# Altium schematic sheet Payload PC104.SchDoc
size A3; SheetNumber: 1; SheetTotal: 1
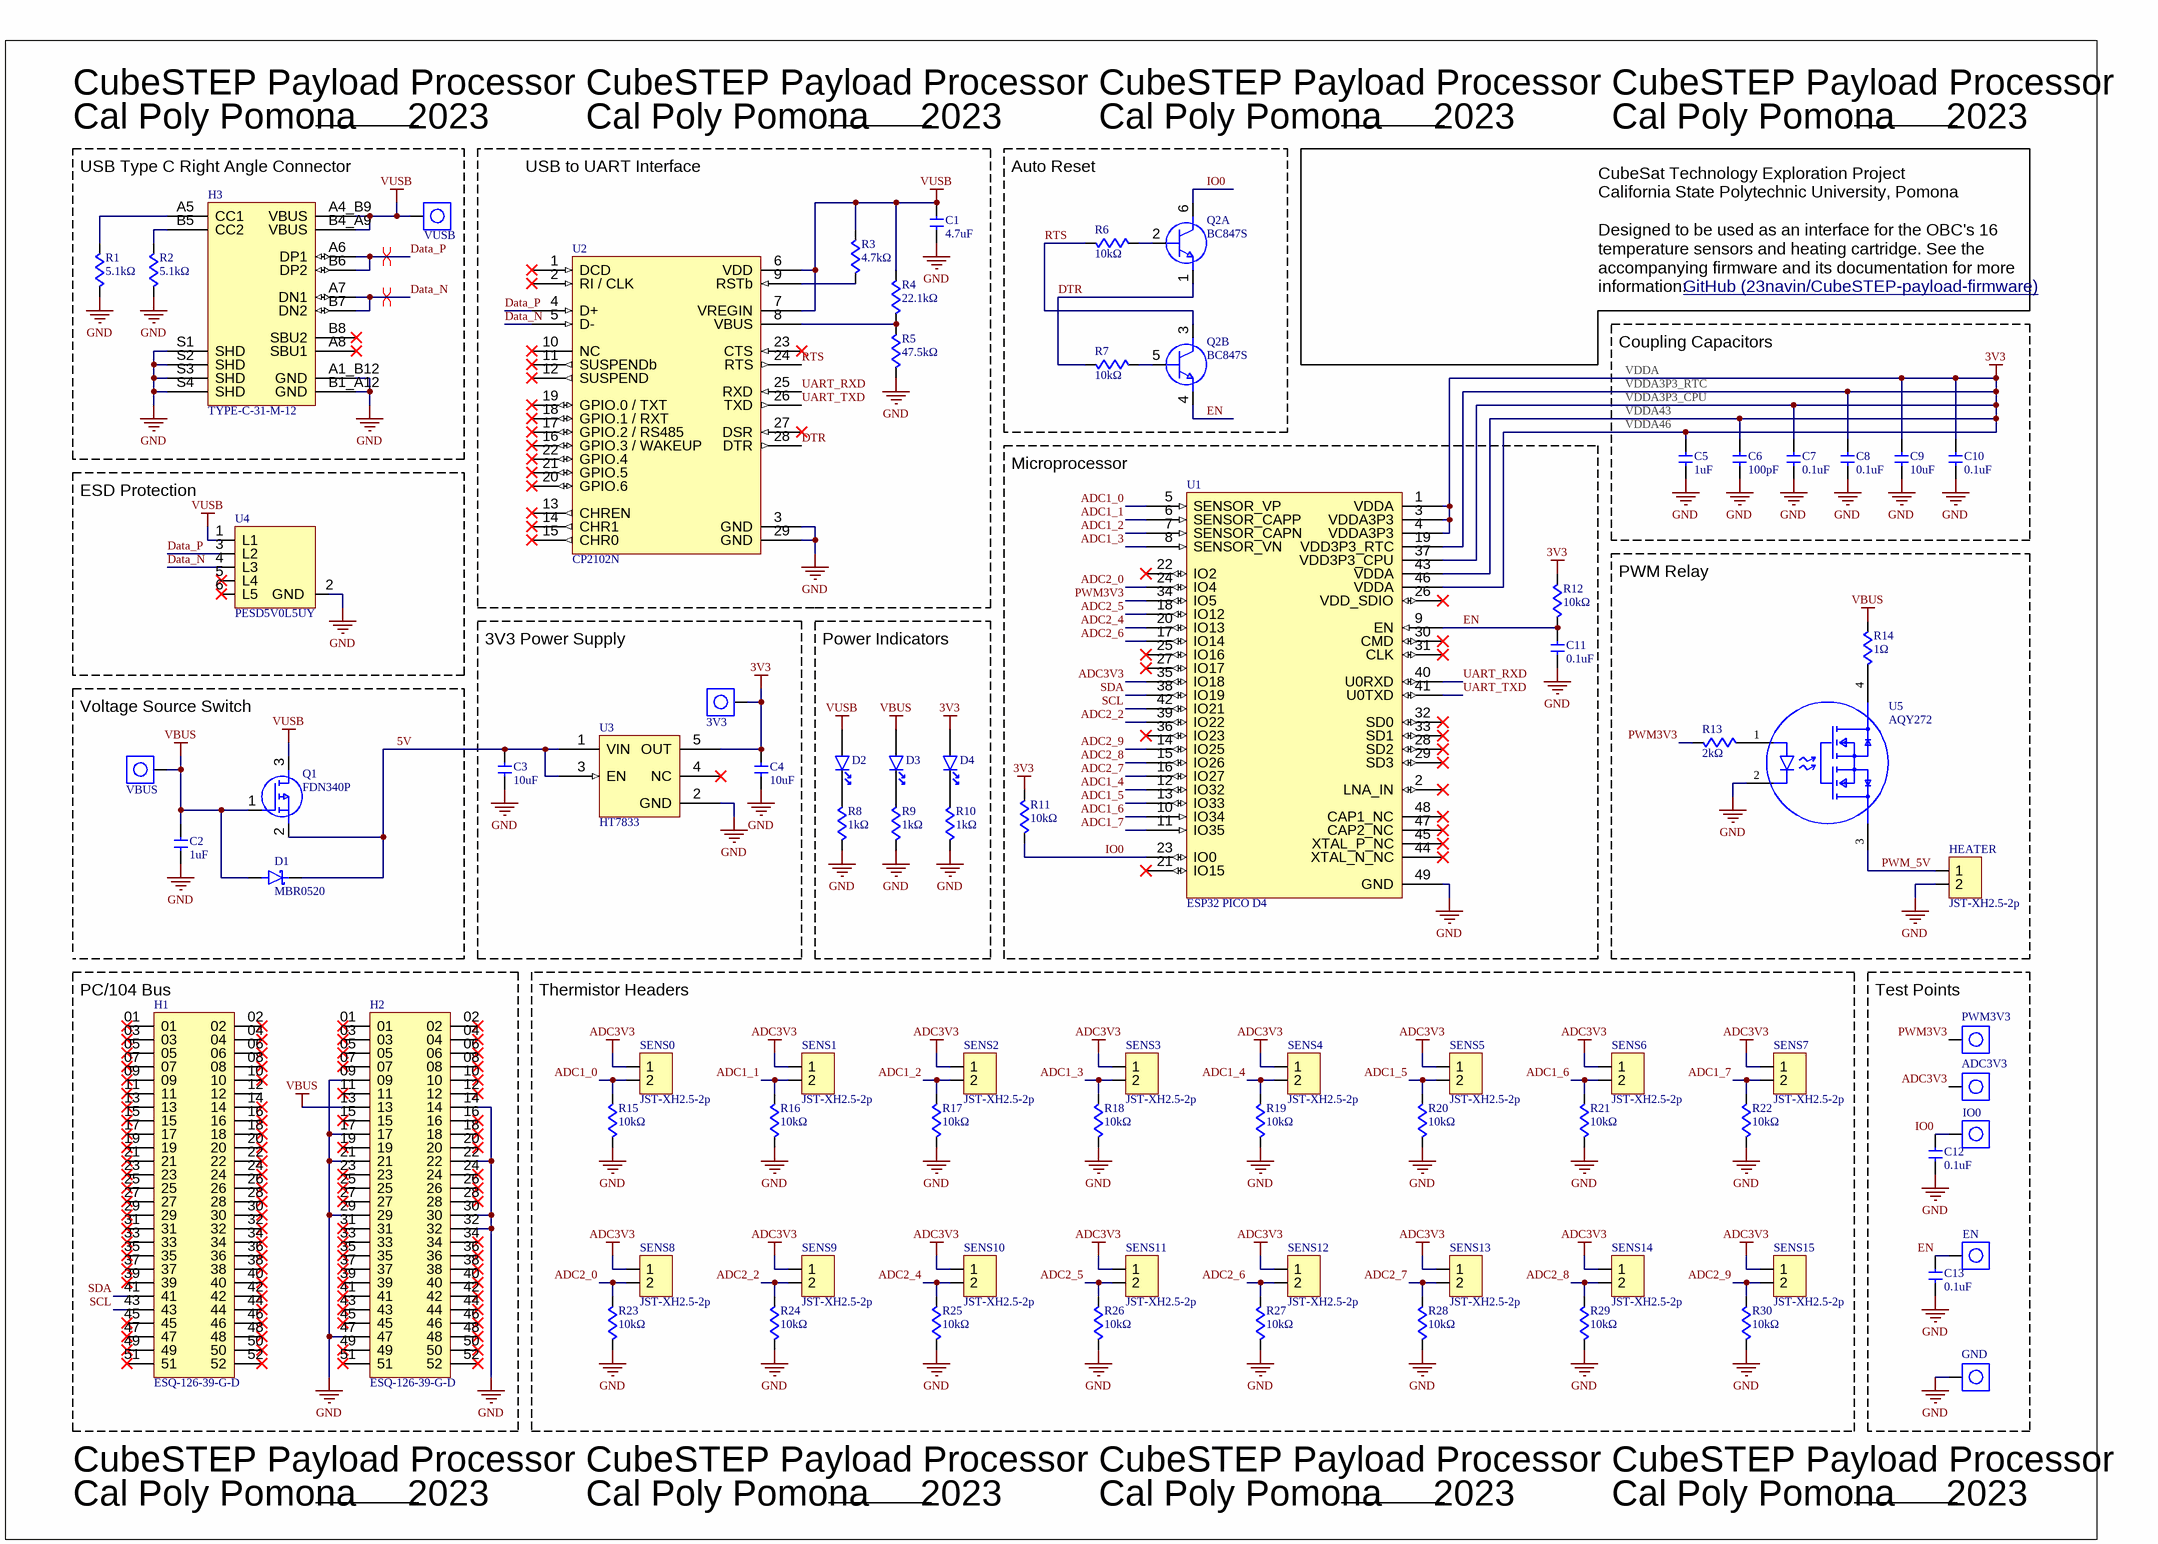
[diagram p0: Payload PC104.SchDoc]

## Parts
3V3  Test Point  [Test Point-Footprint-1]  (value not drawn)
ADC3V3  Test Point  [Test Point-Footprint-1]  (value not drawn)
C1  4.7uF  [0402_Capacitor]
C2  1uF  [0402_Capacitor]
C3  10uF  [0805_Capacitor_Murata]
C4  10uF  [0805_Capacitor_Murata]
C5  1uF  [0402_Capacitor]
C6  100pF  [0402_Capacitor]
C7  0.1uF  [0402_Capacitor]
C8  0.1uF  [0402_Capacitor]
C9  10uF  [0805_Capacitor_Murata]
C10  0.1uF  [0402_Capacitor]
C11  0.1uF  [0402_Capacitor]
C12  0.1uF  [0402_Capacitor]
C13  0.1uF  [0402_Capacitor]
D1  MBR0520  [SOD-123_Diode_Onsemi]
D2  NCD0603R2  [0603_LED]  (value not drawn)
D3  NCD0603R2  [0603_LED]  (value not drawn)
D4  NCD0603R2  [0603_LED]  (value not drawn)
EN  Test Point  [Test Point-Footprint-1]  (value not drawn)
GND  Test Point  [Test Point-Footprint-1]  (value not drawn)
H1  ESQ-126-39-G-D  [ESQ-126-39-G-D]
H2  ESQ-126-39-G-D  [ESQ-126-39-G-D]
H3  TYPE-C-31-M-12  [TYPE-C-31-M-12-Footprint-1]
HEATER  JST-XH2.5-2p  [2.5_2p_Header]
IO0  Test Point  [Test Point-Footprint-1]  (value not drawn)
PWM3V3  Test Point  [Test Point-Footprint-1]  (value not drawn)
Q1  FDN340P  [SOT-23]
Q2  BC847S  [SC-70-6(SOT-363)]  (parts A,B of 2)
R1  5.1kΩ  [0402_Resistor]
R2  5.1kΩ  [0402_Resistor]
R3  4.7kΩ  [0402_Resistor]
R4  22.1kΩ  [0402_Resistor]
R5  47.5kΩ  [0402_Resistor]
R6  10kΩ  [0402_Resistor]
R7  10kΩ  [0402_Resistor]
R8  1kΩ  [0402_Resistor]
R9  1kΩ  [0402_Resistor]
R10  1kΩ  [0402_Resistor]
R11  10kΩ  [0402_Resistor]
R12  10kΩ  [0402_Resistor]
R13  2kΩ  [0402_Resistor]
R14  1Ω  [2010_Resistor]
R15  10kΩ  [0402_Resistor]
R16  10kΩ  [0402_Resistor]
R17  10kΩ  [0402_Resistor]
R18  10kΩ  [0402_Resistor]
R19  10kΩ  [0402_Resistor]
R20  10kΩ  [0402_Resistor]
R21  10kΩ  [0402_Resistor]
R22  10kΩ  [0402_Resistor]
R23  10kΩ  [0402_Resistor]
R24  10kΩ  [0402_Resistor]
R25  10kΩ  [0402_Resistor]
R26  10kΩ  [0402_Resistor]
R27  10kΩ  [0402_Resistor]
R28  10kΩ  [0402_Resistor]
R29  10kΩ  [0402_Resistor]
R30  10kΩ  [0402_Resistor]
SENS0  JST-XH2.5-2p  [2.5_2p_Header]
SENS1  JST-XH2.5-2p  [2.5_2p_Header]
SENS2  JST-XH2.5-2p  [2.5_2p_Header]
SENS3  JST-XH2.5-2p  [2.5_2p_Header]
SENS4  JST-XH2.5-2p  [2.5_2p_Header]
SENS5  JST-XH2.5-2p  [2.5_2p_Header]
SENS6  JST-XH2.5-2p  [2.5_2p_Header]
SENS7  JST-XH2.5-2p  [2.5_2p_Header]
SENS8  JST-XH2.5-2p  [2.5_2p_Header]
SENS9  JST-XH2.5-2p  [2.5_2p_Header]
SENS10  JST-XH2.5-2p  [2.5_2p_Header]
SENS11  JST-XH2.5-2p  [2.5_2p_Header]
SENS12  JST-XH2.5-2p  [2.5_2p_Header]
SENS13  JST-XH2.5-2p  [2.5_2p_Header]
SENS14  JST-XH2.5-2p  [2.5_2p_Header]
SENS15  JST-XH2.5-2p  [2.5_2p_Header]
U1  ESP32 PICO D4  [QFN-48-EP(7x7)]
U2  CP2102N  [QFN-28-EP(5x5)]
U3  HT7833  [SOT-23-5]
U4  PESD5V0L5UY  [SOT-363]
U5  AQY272  [DIP4_AQY272_Panasonic]
VBUS  Test Point  [Test Point-Footprint-1]  (value not drawn)
VUSB  Test Point  [Test Point-Footprint-1]  (value not drawn)

## Blocks framed on the sheet
USB Type C Right Angle Connector: H3 R1 R2 VUSB
USB to UART Interface: C1 R3-R5 U2
Auto Reset: Q2 R6 R7
Coupling Capacitors: C5-C10
ESD Protection: U4
Microprocessor: C11 R11 R12 U1
PWM Relay: HEATER R13 R14 U5
3V3 Power Supply: 3V3 C3 C4 U3
Power Indicators: D2-D4 R8-R10
PC/104 Bus: H1 H2
Thermistor Headers: R15-R30 SENS0-SENS15
Test Points: ADC3V3 C12 C13 EN GND IO0 PWM3V3

## Nets
3V3: 3V3.1(Input) C4.1 C5.1 C6.1 C7.2 C8.2 C9.1 C10.2 D4.2(Anode) R11.1 R12.1 U1.1(VDDA) U1.3(VDDA3P3) U1.4(VDDA3P3) U1.19(VDD3P3_RTC) U1.37(VDD3P3_CPU) U1.43(VDDA) U1.46(VDDA) U3.5(OUT)
ADC3V3: ADC3V3.1(Input) SENS0.1 SENS1.1 SENS2.1 SENS3.1 SENS4.1 SENS5.1 SENS6.1 SENS7.1 SENS8.1 SENS9.1 SENS10.1 SENS11.1 SENS12.1 SENS13.1 SENS14.1 SENS15.1 U1.35(IO18)
GND: C1.2 C2.1 C3.2 C4.2 C5.2 C6.2 C7.1 C8.1 C9.2 C10.1 C11.2 C12.1 C13.1 GND.1(Input) H2.09 H2.14 H2.17 H2.21 H2.22 H2.29 H2.30 H2.32 H2.47 H3.A1_B12(GND) H3.B1_A12(GND) H3.S1(SHD) H3.S2(SHD) H3.S3(SHD) H3.S4(SHD) HEATER.2 R1.1 R2.1 R5.1 R8.2 R9.2 R10.2 R15.1 R16.1 R17.1 R18.1 R19.1 R20.1 R21.1 R22.1 R23.1 R24.1 R25.1 R26.1 R27.1 R28.1 R29.1 R30.1 U1.49(GND) U2.3(GND) U2.29(GND) U3.2(GND) U4.2(GND) U5.2(C)
VBUS: C2.2 D1.2(Anode) D3.2(Anode) H2.13 Q1.1(G) R14.2 VBUS.1(Input)
VUSB: C1.1 D2.2(Anode) H3.A4_B9(VBUS) H3.B4_A9(VBUS) Q1.3(D) R3.2 R4.2 U2.6(VDD) U2.7(VREGIN) U4.1(L1) VUSB.1(Input)
5V: C3.1 D1.1(Cathode) Q1.2(S) U3.1(VIN) U3.3(EN)
ADC1_0: R15.2 SENS0.2 U1.5(SENSOR_VP)
ADC1_1: R16.2 SENS1.2 U1.6(SENSOR_CAPP)
ADC1_2: R17.2 SENS2.2 U1.7(SENSOR_CAPN)
ADC1_3: R18.2 SENS3.2 U1.8(SENSOR_VN)
ADC1_4: R19.2 SENS4.2 U1.12(IO32)
ADC1_5: R20.2 SENS5.2 U1.13(IO33)
ADC1_6: R21.2 SENS6.2 U1.10(IO34)
ADC1_7: R22.2 SENS7.2 U1.11(IO35)
ADC2_0: R23.2 SENS8.2 U1.24(IO4)
ADC2_2: R24.2 SENS9.2 U1.39(IO22)
ADC2_4: R25.2 SENS10.2 U1.20(IO13)
ADC2_5: R26.2 SENS11.2 U1.18(IO12)
ADC2_6: R27.2 SENS12.2 U1.17(IO14)
ADC2_7: R28.2 SENS13.2 U1.16(IO27)
ADC2_8: R29.2 SENS14.2 U1.15(IO26)
ADC2_9: R30.2 SENS15.2 U1.14(IO25)
Data_N: H3.A7(DN1) H3.B7(DN2) U2.5(D-) U4.4(L3)
Data_P: H3.A6(DP1) H3.B6(DP2) U2.4(D+) U4.3(L2)
DTR: Q2.1(S) R7.1 U2.28(DTR)
EN: C11.1 C13.2 EN.1(Input) Q2.4(S) R12.2 U1.9(EN)
IO0: C12.2 IO0.1(Input) Q2.6(D) R11.2 U1.23(IO0)
PWM3V3: PWM3V3.1(Input) R13.1 U1.34(IO5)
PWM_5V: HEATER.1 U5.3(1_DRAIN)
RTS: Q2.3(D) R6.1 U2.24(RTS)
SCL: H1.43 U1.42(IO21)
SDA: H1.41 U1.38(IO19)
UART_RXD: U1.40(U0RXD) U2.25(RXD)
UART_TXD: U1.41(U0TXD) U2.26(TXD)
NetD2_1: D2.1(Cathode) R8.1
NetD3_1: D3.1(Cathode) R9.1
NetD4_1: D4.1(Cathode) R10.1
NetH3_A5: H3.A5(CC1) R1.2
NetH3_B5: H3.B5(CC2) R2.2
NetQ2_2: Q2.2(G) R6.2
NetQ2_5: Q2.5(G) R7.2
NetR3_1: R3.1 U2.9(RSTb)
NetR4_1: R4.1 R5.2 U2.8(VBUS)
NetR13_2: R13.2 U5.1(A)
NetR14_1: R14.1 U5.4(2_DRAIN)

Not connected (* = marked no-connect by the designer): H1 01* 02* 03* 04* 05* 06* 07* 08* 09* 10* 11* 12 13* 14* 15* 16* 17* 18* 19* 20* 21* 22* 23* 24* 25* 26* 27* 28* 29* 30* 31* 32* 33* 34* 35* 36* 37* 38* 39* 40* 42* 44* 45* 46* 47* 48* 49* 50* 51* 52*; H2 01* 02* 03* 04* 05* 06* 07* 08* 10* 11* 12* 15* 16* 18* 19* 20* 23* 24* 25* 26* 27* 28* 31* 33* 34* 35* 36* 37* 38* 39* 40* 41* 42* 43* 44* 45* 46* 48* 49* 50* 51* 52*; H3 A8(SBU1)* B8(SBU2)*; U1 2(LNA_IN)* 21(IO15)* 22(IO2)* 25(IO16)* 26(VDD_SDIO)* 27(IO17)* 28(SD2)* 29(SD3)* 30(CMD)* 31(CLK)* 32(SD0)* 33(SD1)* 36(IO23)* 44(XTAL_N_NC)* 45(XTAL_P_NC)* 47(CAP2_NC)* 48(CAP1_NC)*; U2 1(DCD)* 2(RI_/_CLK)* 10(NC)* 11(SUSPENDb)* 12(SUSPEND)* 13(CHREN)* 14(CHR1)* 15(CHR0)* 16(GPIO.3_/_WAKEUP)* 17(GPIO.2_/_RS485)* 18(GPIO.1_/_RXT)* 19(GPIO.0_/_TXT)* 20(GPIO.6)* 21(GPIO.5)* 22(GPIO.4)* 23(CTS)* 27(DSR)*; U3 4(NC)*; U4 5(L4)* 6(L5)*

## Layout directives
differential pair: Data_N, Data_P

## Notes on the sheet
- CubeSTEP Payload Processor
- Cal Poly Pomona
- 2023
- GitHub (23navin/CubeSTEP-payload-firmware) <https://github.com/23navin/CubeSTEP-payload-firmware>
- CubeSat Technology Exploration Project
  California State Polytechnic University, Pomona
  Designed to be used as an interface for the OBC's 16 temperature sensors and heating cartridge. See the accompanying firmware and its documentation for more information:
- VDDA
- VDDA3P3_RTC
- VDDA3P3_CPU
- (near C5) VDDA43
- (near C5) VDDA46
- Voltage Source Switch

## Library data of the parts
3V3 ADC3V3 EN GND IO0 PWM3V3 VBUS VUSB = CMP-00032-2: Signal test point
C1 = CMP-00010-12: ±20% 16V X5R SMD 0402; Part Number: CM05X5R475M16AH; Type: Ceramic; Capacitance: 4.7uF; Temperature Coefficient: X5R; Manufacturer: --; JLCPCB Part #: C697614; Mount: Surface Mount; Max Operating Temperature: 85°C; Footprint: 0402; Overload Voltage: 16V; Tolerance: ±20%; Min Operating Temperature: -55°C
C2 C5 = CMP-00014-10: ±10% 16V X5R SMD 0402; Part Number: GRM155R61C105KA12D; Manufacturer: Murata Electronics; Type: Ceramic; ComponentLink1URL: https://jlcpcb.com/partdetail/MurataElectronics-GRM155R61C105KA12D/C77006; Mount: Surface Mount; Min Operating Temperature: -55°C; Temperature Coefficient: X5R; Max Operating Temperature: 85°C; JLCPCB Part #: C77006; Tolerance: ±10%; Size Code: 0402; Footprint: 0402; Capacitance: 1uF; ComponentLink1Description: JLCPCB; Overload Voltage: 16V
C3 C4 C9 = CMP-00013-10: ±10% 16V B SMD 0805; Part Number: GRM21BB31C106KE15L; Manufacturer: Murata Electronics; Type: Ceramic; Temperature Coefficient: B; Mount: Surface Mount; Capacitance: 10uF; Min Operating Temperature: -25°C; JLCPCB Part #: C162317; Overload Voltage: 16V; Max Operating Temperature: 85°C; Tolerance: ±10%; Footprint: 0805
C6 = CMP-00020-1: ±10% 16V X5R SMD 0402; Manufacturer: YAGEO; Part Number: CC0402KRX7R7BB101; Type: Ceramic; Temperature Coefficient: X7R; Mount: Surface Mount; Footprint: 0402; Min Operating Temperature: -55°C; Tolerance: ±10%; Overload Voltage: 16V; Capacitance: 100pF; JLCPCB Part #: C541374; JLCPCB: https://jlcpcb.com/partdetail/Yageo-CC0402KRX7R7BB101/C541374; Max Operating Temperature: 125°C; Size Code: 0402
C7 C8 C10-C13 = CMP-00011-10: ±20% 16V X5R SMD 0402; Part Number: TCC0402X5R104M160AT; Manufacturer: CCTC; Type: Ceramic; Tolerance: ±20%; Temperature Coefficient: X5R; Capacitance: 0.1uF; Footprint: 0402; Overload Voltage: 16V; JLCPCB Part #: C344190; Max Operating Temperature: 85°C; Mount: Surface Mount; Min Operating Temperature: -55°C
D1 = CMP-00018-12: Rectifier Diode, Schottky, 1 Phase, 1 Element, 0.5A, 20V V(RRM), Silicon; Additional Feature: FREE WHEELING DIODE; Time @ Peak Reflow Temperature-Max (s): 30s; Max Output Current: 500mA; Forward Voltage-Max (VF): 385mV; Package Body Material: Plastic; Non-rep Pk Forward Current-Max: 5.5A; Qualification Status: Not Qualified; Number of Elements: 1; Package Shape: Rectangular; JESD-30 Code: R-PDSO-G2; Surface Mount: Yes; Max Operating Temperature: 125°C; JLCPCB Part #: C475717; Terminal Finish: Tin; Package Style: SMALL OUTLINEMeter; Number of Pins: 2; Min Operating Temperature: -65°C; Peak Reflow Temperature (Cel): 260°C; Footprint: SOD-123; RoHS Compliant: Yes; Diode Element Material: SILICON; Terminal Position: DUAL; Moisture Sensitivity Level: 1; JESD-609 Code: e3; Reach SVHC Compliant: Yes; Technology: SCHOTTKY; Terminal Form: Gull Wing; Rep Pk Reverse Voltage-Max: 20V; Diode Type: RECTIFIER
D2-D4 = CMP-00019-7: Colorless transparence 65mcd~150mcd 615nm~630nm -30℃~+85℃ Red 130° 65mW 0603 Light Emitting Diodes (LED) ROHS; Forward Current: 20mA; Forward Voltage (VF): 1.6V~2.6V; Lens Color: Colorless transparence; Power Dissipation: 65mW; Viewing Angle: 130°; Operating Temperature: -30℃~+85℃; JLCPCB Part #: C90692; Footprint: 0603; Lumunous Intensity: 65mcd~150mcd; Emitted Color: Red; Dominant Wavelength: 615nm~630nm
H1 H2 = CMP-00000-5: Board Connector, 52 Contact(s), 2 Row(s), Female, Straight, 0.1 inch Pitch, Solder Terminal, Locking, Black Insulator, Socket; Contact Pattern: RECTANGULAR; Plating Thickness: 20uin; Reliability: COMMERCIAL; Contact Resistance: 10mR; Mating Information: MULTIPLE MATING PARTS AVAILABLE; Number Of PCB Rows: 2; Filter Feature: No; Polarization Key: POLARIZED HOUSING; Reference Standard: UL; Contact Style: SQ PIN-SKT; PCB Contact Row Spacing: 2.54mm; Body Depth: 0.435inch; Number of Contacts: 52; Number Of Connectors: 1; Option: General Purpose; Body Length: 2.62inch; Rated Current (Signal): 5.7A; Body Breadth: 0.195inch; Min Operating Temperature: -55°C; Mounting Option 1: LOCKING; PCB Contact Pattern: RECTANGULAR; Insulation Color: Black; Contact Finish - Termination: Gold (Au) - with Nickel (Ni) barrier; Reach SVHC Compliant: Yes; Mating Contact Pitch: 0.1inch; Insulation Material: Thermoplastic; Contact Gender: Female; JESD-609 Code: e4; Mount: Board; Mounting Style: STRAIGHT; Termination: Solder; Contact Material: Bronze; Number of Rows Loaded: 2; MIL Conformance: No; Mixed Contacts: No; Mating Contact Row Spacing: 0.1inch; IEC Conformance: No; Terminal Length: 0.48inch; Body/Shell Style: SOCKET; RoHS Compliant: Yes; DIN Conformance: No; Contact Finish - Mating: GOLD (20) OVER NICKEL (50); Connector Type: BOARD CONNECTOR; Max Operating Temperature: 125°C; Terminal Pitch: 2.54mm
H3 = CMP-00003-9: 5A 1 16P Female Type-C SMD USB Connectors ROHS; JLCPCB Part #: C165948; Footprint: SMD
HEATER SENS0-SENS15 = CMP-00005-8: 1x2P XH 1 2.5mm 2 Brass Push-Pull,P=2.5mm Wire To Board / Wire To Wire Connector ROHS; Manufacturer: Ckmtw(Shenzhen Cankemeng); Assembly: Wave Soldering; Footprint: Push-Pull,P=2.5mm; Package: Push-Pull,P=2.5mm; JLCPCB Part #: C132479
Q1 = CMP-00008-5: SOT-23 MOSFETs ROHS; Power Dissipation-Max (Abs): 500mW; Transistor Application: SWITCHING; DS Breakdown Voltage-Min: 20V; Drain-source On Resistance-Max: 70R; Polarity/Channel Type: P-CHANNEL; Transistor Element Material: SILICON; Qualification Status: Not Qualified; Operating Mode: ENHANCEMENT MODE; FET Technology: METAL-OXIDE SEMICONDUCTOR; Package Body Material: Plastic; Number of Elements: 1; Drain Current-Max (ID): 2A; RoHS Compliant: Yes; Max Operating Temperature: 150°C; Package Style: SMALL OUTLINEMeter; JESD-609 Code: e3; Reach SVHC Compliant: Yes; JESD-30 Code: R-PDSO-G3; Terminal Form: Gull Wing; Terminal Finish: Tin; Terminal Position: DUAL; Package Shape: Rectangular; Moisture Sensitivity Level: 1; JLCPCB Part #: C347510; Number of Pins: 3; Surface Mount: Yes; Footprint: SOT_23; Drain Current-Max (Abs) (ID): 2A
Q2 = CMP-00009-9: Small Signal Bipolar Transistor, 0.1A I(C), 45V V(BR)CEO, 2-Element, NPN, Silicon; Transistor Application: AMPLIFIER; DC Current Gain-Min (hFE): 200; Number of Elements: 2; Max Collector Current: 100mA; Transition Frequency-Nom (fT): 250MHz; Package Body Material: Plastic; Qualification Status: Not Qualified; Max Operating Temperature: 150°C; RoHS Compliant: Yes; Terminal Position: DUAL; Transistor Element Material: SILICON; Surface Mount: Yes; Package Style: SMALL OUTLINEMeter; Collector-emitter Voltage-Max: 45V; Terminal Form: Gull Wing; Reach SVHC Compliant: Yes; Number of Pins: 6; JESD-30 Code: R-PDSO-G6; Moisture Sensitivity Level: 1; JLCPCB Part #: C148112; Polarity/Channel Type: NPN; Package Shape: Rectangular
R1 R2 = CMP-00031-23: ±0.5% 62.5mW 50V SMD 0402; Part Number: 0402WGD5101TCE; Manufacturer: UNI-ROYAL(Uniroyal Elec); Temperature Coefficient: ±100ppm/°C; Min Operating Temperature: -55°C; Type: Thick Film; Footprint: 0402; Power: 62.5mW; Resistor Type: Fixed; JLCPCB Part #: C423276; Tolerance: ±0.5%; Resistance: 5.1kΩ; Mount: Surface Mount; Max Operating Temperature: 155°C; Overload Voltage: 50V
R3 = CMP-00024-22: ±1% 62.5mW 50V SMD 0402; Part Number: RC0402FR-074K7L; Manufacturer: YAGEO; Temperature Coefficient: ±100ppm/°C; Type: Thick Film; Resistor Type: Fixed; Resistance: 4.7kΩ; Power: 62.5mW; Min Operating Temperature: -55°C; Footprint: 0402; Overload Voltage: 50V; Tolerance: ±1%; JLCPCB Part #: C105871; Max Operating Temperature: 155°C; Mount: Surface Mount
R4 = CMP-00022-22: ±1% 62.5mW50V SMD 0402; Part Number: RC0402FR-0722K1L; Manufacturer: YAGEO; Overload Voltage: 50V; Power: 62.5mW; Temperature Coefficient: ±100ppm/°C; Footprint: 0402; Resistance: 22.1kΩ; JLCPCB Part #: C163478; Max Operating Temperature: 155°C; Min Operating Temperature: -55°C; Type: Thick Film; Tolerance: ±1%; Resistor Type: Fixed; Mount: Surface Mount
R5 = CMP-00029-21: ±1% 62.5mW 50V SMD 0402; Part Number: RC0402FR-0747K5L; Manufacturer: YAGEO; Temperature Coefficient: ±100ppm/°C; Mount: Surface Mount; Overload Voltage: 50V; Power: 62.5mW; Footprint: 0402; Resistance: 47.5kΩ; Min Operating Temperature: -55°C; Tolerance: ±1%; Resistor Type: Fixed; JLCPCB Part #: C137974; Type: Thick Film; Max Operating Temperature: 155°C
R6 R7 R11 R12 R15-R30 = CMP-00021-24: ±1% 62.5mW 50V SMD 0402; Manufacturer: FH (Guangdong Fenghua Advanced Tech); Part Number: RC-02W1002FT; Temperature Coefficient: ±200ppm/℃; Type: Thick Film; Footprint: 0402; Power: 62.5mW; Mount: Surface Mount; Resistance: 10kΩ; Resistor Type: Fixed; Min Operating Temperature: -55°C; Tolerance: ±1%; JLCPCB Part #: C258091; Max Operating Temperature: 155°C; Overload Voltage: 50V
R8-R10 = CMP-00025-21: ±1% 62.5mW 50V SMD 0402; Manufacturer: YAGEO; Part Number: RC0402FR-071KL; Temperature Coefficient: ±100ppm/°C; Resistance: 1kΩ; JLCPCB Part #: C106235; Mount: Surface Mount; Type: Thick Film; Tolerance: ±1%; Overload Voltage: 50V; Footprint: 0402; Min Operating Temperature: -55°C; Max Operating Temperature: 155°C; Power: 62.5mW; Resistor Type: Fixed
R13 = CMP-00027-22: ±1% 62.5mW 50V SMD 0402; Part Number: CR0402FF2001G; Manufacturer: LIZ Elec; Temperature Coefficient: ±200ppm/℃; Tolerance: ±1%; JLCPCB Part #: C100291; Footprint: 0402; Min Operating Temperature: -55°C; Max Operating Temperature: 125°C; Overload Voltage: 50V; Power: 62.5mW; Type: Thick Film; Mount: Surface Mount; Resistance: 2kΩ; Resistor Type: Fixed
R14 = CMP-00017-16: ±5% 0.75W 200V SMD 2010; Manufacturer: RALEC; Part Number: RTT201R00FTE; Power: 750mW; Temperature Coefficient: ±400ppm/°C; Mount: Surface Mount; Footprint: 2010; Resistor Type: Fixed; Tolerance: ±5%; Type: Thick Film; Resistance: 1Ω; JLCPCB Part #: C137062; Overload Voltage: 200V; Max Operating Temperatrure: 155°C; Min Operating Temperature: -55°C
U1 = CMP-00001-9: System-on-Chip integrating an ESP32 chip together with a 4 MB SPI flash; Part Number: ESP32-PICO-D4; Manufacturer: Espressif Systems; JLCPCB Part #: C193707; ComponentLink1URL: https://jlcpcb.com/partdetail/EspressifSystems-ESP32_PICOD4/C193707; ComponentLink1Description: JLCPCB
U2 = CMP-00002-10: USB-to-UART bridge controller; Manufacturer: SILICON LABS; ComponentLink1Description: JLCPCB; ComponentLink1URL: https://jlcpcb.com/partdetail/SiliconLabs-CP2102N_A02GQFN28R/C964632; JLCPCB Part #: C964632; Part Number: CP2102N-A02-GQFN28R
U3 = CMP-00007-5: SOT-23-5 Linear Voltage Regulators (LDO) ROHS; Manufacturer: TECH PUBLIC; Part Number: HT7833; JLCPCB Part #: C3011187; ComponentLink1Description: JLCPCB; ComponentLink1URL: https://jlcpcb.com/partdetail/TECHPUBLIC-HT7833/C3011187
U4 = CMP-00004-7: Trans Voltage Suppressor Diode, 25W, 5V V(RWM), Unidirectional, 5 Element, Silicon; Manufacturer: UMW(Youtai Semiconductor Co., Ltd.); JLCPCB Part #: C2831528; ComponentLink1Description: JLCPCB; Part Number: PESD5V0L5UY; ComponentLink1URL: https://jlcpcb.com/partdetail/2985836-PESD5V0L5UY/C2831528
U5 = CMP-00016-6: Solid State Relays 1.25V 60V 0.11Ω 2A AC,DC DIP-4 - MOS Output (PhotoMOS) ROHS 1 Form A(SPST-NO); Number of Elements: 1; Output Circuit Type: MOSFET; Overall Height: 3.9mm; Control Voltage: 1.16V; Optoelectronic Device Type: TRANSISTOR OUTPUT SSR; Forward Current-Max: 50mA; On-state Resistance-Max: 180mR; Control Current: 1mA; Isolation Voltage-Max: 2.5kV; JLCPCB Part #: C62652; Min Operating Temperature: -40°C; Length: 9.3mm; Max Operating Temperature: 85°C; Footprint: 4-DIP (0.400", 10.16mm); Input Type: DC; RoHS Compliant: Yes; JESD-609 Code: e3; On-State Current-Max: 2A; Reach SVHC Compliant: Yes; Terminal Finish: Tin